# Altium project PCB_Project.PrjPcb
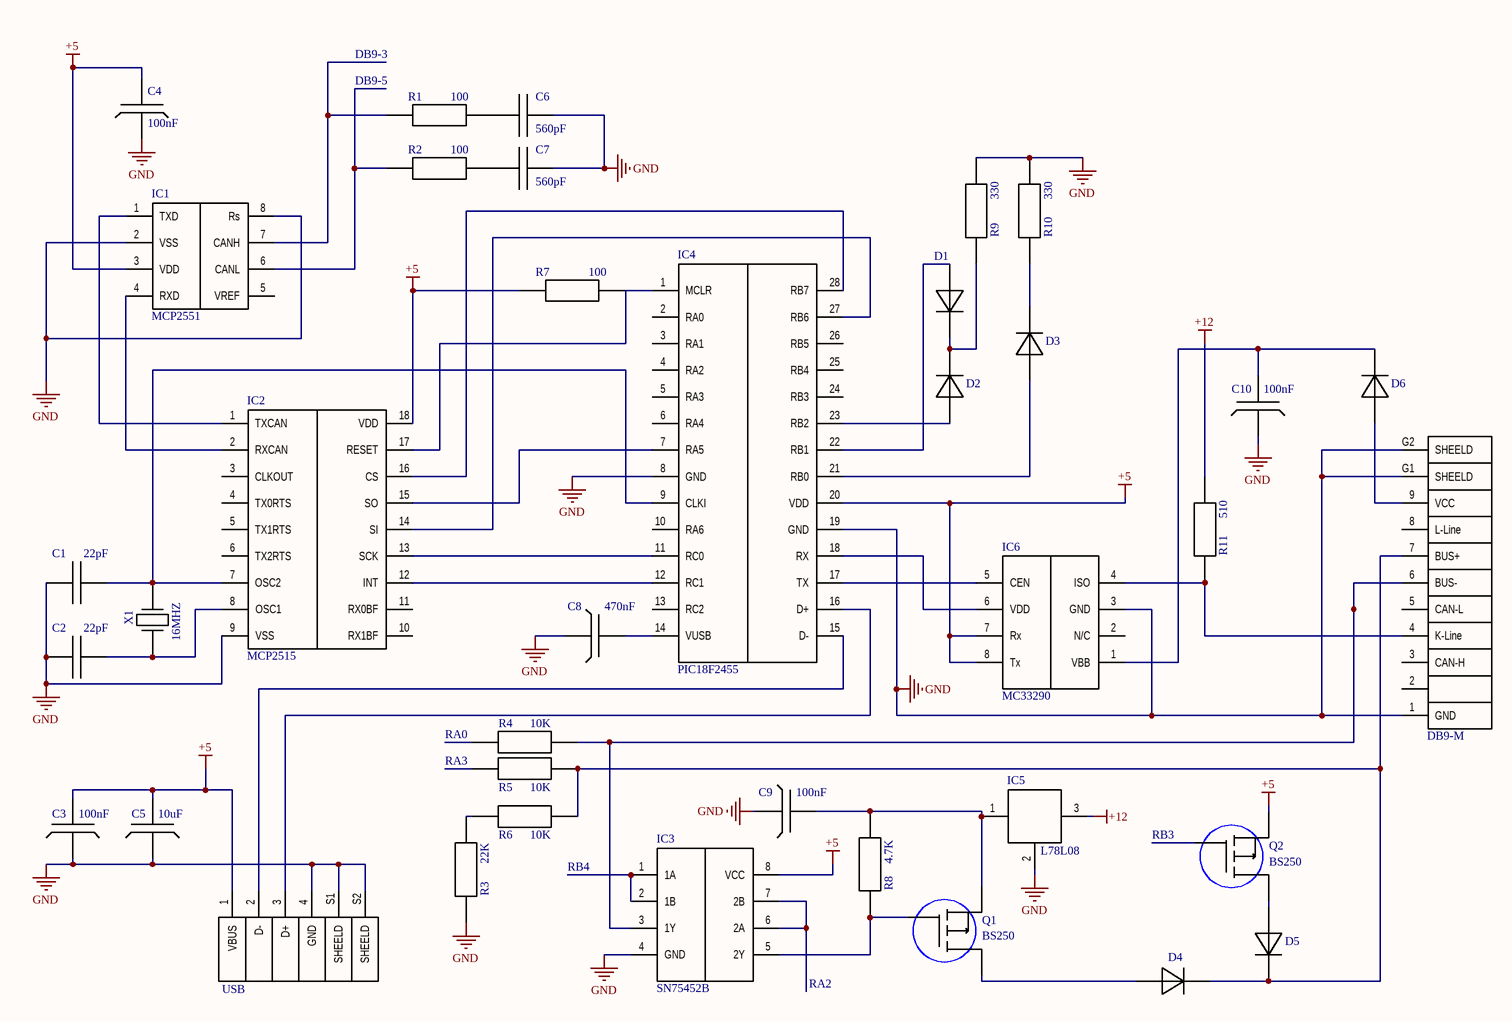
[diagram p0: Sheet1.SchDoc]
1 sheet, 38 parts. Net scope: global (net labels, ports and power ports of the same name join across sheets).
Board file: PCB1.PcbDoc

## Sheet Sheet1.SchDoc
size 420 x 297 mm; SheetNumber: 1; SheetTotal: 1

### Parts
C1  22pF  [C0805]
C2  22pF  [C0805]
C3  100nF  [C0805]
C4  100nF  [C0805]
C5  10uF  [C0805]
C6  560pF  [C0805]
C7  560pF  [C0805]
C8  470nF  [C0805]
C9  100nF  [C0805]
C10  100nF  [C0805]
D1  Diode  [1N4148]  (value not drawn)
D2  Diode  [1N4148]  (value not drawn)
D3  Diode  [1N4148]  (value not drawn)
D4  Diode  [1N4148]  (value not drawn)
D5  Diode  [1N4148]  (value not drawn)
D6  Diode  [1N4148]  (value not drawn)
IC1  MCP2551  [SOIC127P599X175-8N]
IC2  MCP2515  [MCP2515]
IC3  SN75452B  [SOIC127P599X175-8N]
IC4  PIC18F2455  [SOIC-SO28_N]
IC5  L78L08  [L78L08]
IC6  MC33290  [SO08]
P1  USB  [USB-A1HSW6]
P2  DB9-M  [DB9]
Q1  BS250  [BS250FTA]
Q2  BS250  [BS250FTA]
R1  100  [J1-0603]
R2  100  [J1-0603]
R3  22K  [J1-0603]
R4  10K  [J1-0603]
R5  10K  [J1-0603]
R6  10K  [J1-0603]
R7  100  [J1-0603]
R8  4.7K  [J1-0603]
R9  330  [J1-0603]
R10  330  [J1-0603]
R11  510  [J1-0603]
X1  16MHZ  [X-16.000MHZ-B4]

### Nets
+5: C3.1 C4.1 C5.1 IC1.3(VDD) IC2.18(VDD) IC3.8(VCC) IC4.20(VDD) IC6.7(Rx) IC6.8(Tx) P1.1(VBUS) Q2.2(S) R7.1
+12: IC5.3(IN) R11.2
GND: C1.1 C2.1 C3.2 C4.2 C5.2 C6.2 C7.2 C8.2 C9.2 C10.2 IC1.2(VSS) IC1.8(Rs) IC2.9(VSS) IC3.4(GND) IC4.8(GND) IC4.19(GND) IC5.2(GND) IC6.3(GND) P1.4(GND) P1.S1(SHEELD) P1.S2(SHEELD) P2.1(GND) P2.G1(SHEELD) P2.G2(SHEELD) R3.1 R9.2 R10.2
NetC1_2: C1.2 IC2.7(OSC2) IC4.9(CLKI) X1.2
NetC2_2: C2.2 IC2.8(OSC1) X1.1
NetC6_1: C6.1 R1.2
NetC7_1: C7.1 R2.2
NetC8_1: C8.1 IC4.14(VUSB)
NetC9_1: C9.1 IC5.1(OUT) Q1.2(S) R8.2
NetC10_1: C10.1 D6.2 IC6.1(VBB)
NetD1_1: D1.1 IC4.22(RB1)
NetD1_2: D1.2 D2.2 R9.1
NetD2_1: D2.1 IC4.23(RB2)
NetD3_1: D3.1 IC4.21(RB0)
NetD3_2: D3.2 R10.1
NetD4_1: D4.1 Q1.3(D)
NetD4_2: D4.2 D5.2 P2.7(BUS+) R5.2 R6.2
NetD5_1: D5.1 Q2.3(D)
NetD6_1: D6.1 P2.9(VCC)
NetIC1_1: IC1.1(TXD) IC2.1(TXCAN)
NetIC1_4: IC1.4(RXD) IC2.2(RXCAN)
NetIC1_6: IC1.6(CANL) R2.1
NetIC1_7: IC1.7(CANH) R1.1
NetIC2_12: IC2.12(INT) IC4.12(RC1)
NetIC2_13: IC2.13(SCK) IC4.11(RC0)
NetIC2_14: IC2.14(SI) IC4.27(RB6)
NetIC2_15: IC2.15(SO) IC4.7(RA5)
NetIC2_16: IC2.16(CS) IC4.28(RB7)
NetIC2_17: IC2.17(RESET) IC4.1(MCLR) R7.2
NetIC3_1: IC3.1(1A) IC3.2(1B)
NetIC3_3: IC3.3(1Y) P2.6(BUS-) R4.2
NetIC3_5: IC3.5(2Y) Q1.1(G) R8.1
NetIC3_6: IC3.6(2A) IC3.7(2B)
NetIC4_15: IC4.15(D-) P1.2(D-)
NetIC4_16: IC4.16(D+) P1.3(D+)
NetIC4_17: IC4.17(TX) IC6.5(CEN)
NetIC4_18: IC4.18(RX) IC6.6(VDD)
NetIC6_4: IC6.4(ISO) P2.4(K-Line) R11.1
NetR3_2: R3.2 R6.1

Not connected (* = marked no-connect by the designer): IC1 5(VREF); IC2 3(CLKOUT) 4(TX0RTS) 5(TX1RTS) 6(TX2RTS) 10(RX1BF) 11(RX0BF); IC4 2(RA0) 3(RA1) 4(RA2) 5(RA3) 6(RA4) 10(RA6) 13(RC2) 24(RB3) 25(RB4) 26(RB5); IC6 2(N/C); P2 2 3(CAN-H) 5(CAN-L) 8(L-Line); Q2 1(G); R4 1; R5 1

### Notes on the sheet
- DB9-3
- (near R1) DB9-5
- RA0
- RA3
- RB4
- (near Q2) RB3
- RA2
- ГУИР.441272.001
- Перв. примен.
- Справ. №
- Подп. и дата
- Инв. № дубл.
- Взам. инв. №
- Изм.
- Лист
- № докум.
- Подп.
- Дата
- Адаптер для диагностики
- автомобильного оборудования
- Лит.
- Масса
- Масштаб
- Разраб.
- Пров.
- Т.контр.
- Кириленко Г. Б.
- Смирнова Н. А.
- Схема электрическая принципиальная
- У
- 1
- Листов
- Инв. № подп.
- Н.контр.
- БГУИР гр. 990241
- Утв.
- Оформил
- Формат     А3

### Library data of the parts
C1 C2 C6 C7 = Cap: Capacitor; Published: 8-Jun-2000; LatestRevisionDate: 29-May-2009; LatestRevisionNote: IPC-7351 Footprint Added.; PackageReference: C0805; Publisher: Altium Limited; PackageDescription: Chip Capacitor
C3-C5 C8-C10 = Cap External: Capacitor with a designated external electrode; Published: 8-Jun-2000; LatestRevisionDate: 29-May-2009; LatestRevisionNote: IPC-7351 Footprint Added.; PackageReference: C0805; Publisher: Altium Limited; PackageDescription: Chip Capacitor
D1-D6 = Diode: Default Diode; Published: 8-Jun-2000; LatestRevisionDate: 17-Jul-2002; LatestRevisionNote: Re-released for DXP Platform.; PackageVersion: Sep-1996; PackageReference: SMC; Publisher: Altium Limited; PackageDescription: DO-214-AB/SMC; 2 C-Bend Leads; Body 7.9 x 5.9 mm, inc. leads (LxW); Code_JEDEC: DO-214-AB
IC1 = MCP2551-I/SN: Package: None; MP: MCP2551-I/SN; Price: None; Availability: Unavailable; Value: *
IC2 = MCP2515-E/SO: CANbus Controller CAN 2.0 SPI Interface 18-SOIC; MF: Microchip; MP: MCP2515-E/SO; Price: None; Package: SOIC-18 Microchip; Availability: Unavailable; SnapEDA_Link: https://www.snapeda.com/parts/MCP2515-E/SO/Microchip/view-part/100602/?ref=snap; Value: *
IC3 = SN75452BD: 30-V Dual output driver with NAND logic inputs; MF: Texas Instruments; Purchase-URL: https://pricing.snapeda.com/search/part/SN75452BD/?ref=eda; Value: *; SnapEDA_Link: https://www.snapeda.com/parts/SN75452BD/Texas+Instruments/view-part/?ref=snap; Package: SOIC-8 Texas Instruments; MP: SN75452BD; Check_prices: https://www.snapeda.com/parts/SN75452BD/Texas+Instruments/view-part/?ref=eda; Price: None; Availability: In Stock
IC4 = PIC18F2455-I/SO: High Performance, Enhanced Flash, USB Microcontroller with nanoWatt Technology, 24K Flash, 28-Pin SOIC, Industrial Temperature Range; Published: 29-Jan-2009; LatestRevisionDate: 02-Dec-2009; LatestRevisionNote: Updated to datasheet revision E, Aug-2008; DatasheetVersion: revE, Aug-2008; PackageVersion: revBB, Aug-2009; PackageReference: SOIC-SO28; Publisher: Altium Limited; PackageDescription: 28-Lead Plastic Small Outline (SO) - Wide 7.50mm Body [SOIC]; Supplier 1: Digi-Key; Supplier Part Number 1: PIC18F2455-I/SO-ND; Supplier 2: Farnell; Supplier Part Number 2: 1579598; Code_JEDEC: MS-013; ComponentLink1Description: Datasheet; ComponentLink1URL: http://ww1.microchip.com/downloads/en/DeviceDoc/39632e.pdf; ComponentLink2Description: Packaging Specification; ComponentLink2URL: http://www.microchip.com/stellent/groups/techpub_sg/documents/packagingspec/en012702.pdf; ComponentLink3Description: Microchip.com Home; ComponentLink3URL: http://www.microchip.com/
IC5 = L78L05ACU: Linear Voltage Regulator IC 1 Output 100mA SOT-89-3; MF: STMicroelectronics; Availability: Unavailable; Price: None; Package: SOT-89-3 STMicroelectronics; Value: *; SnapEDA_Link: https://www.snapeda.com/parts/L78L05ACU/STMicroelectronics/view-part/1236826/?ref=snap; MP: L78L05ACU
IC6 = MC33290: Heat Sink; Packages Cooled:TO-220; Thermal Resistance:8.8Â°C/W; Width:34.5mm; Height:50mm; Length:12.5mm; Mounting Type:PC Board Thru Hole; Package / Case:TO-220 ;RoHS Compliant: Yes; MF: NXP USA; Check_prices: https://www.snapeda.com/parts/MC33290/NXP+USA+Inc./view-part/?ref=eda; Package: TO-220-3 ON Semiconductor; MP: MC33290; Value: *; SnapEDA_Link: https://www.snapeda.com/parts/MC33290/NXP+USA+Inc./view-part/?ref=snap; Availability: In Stock; Price: None
P1 = USB-A1HSW6: USB - A Receptacle Connector 4 Position Through Hole, Right Angle; Price: None; Package: None; Availability: Unavailable; MP: USB-A1HSW6; Value: *
Q1 Q2 = BS250FTA: P-Channel 45V 90mA (Ta) 330mW (Ta) Surface Mount SOT-23-3; MF: Diodes Inc.; DigiKey-Purchase-URL: https://snapeda.com/shop?store=DigiKey&id=699; SnapEDA_Link: https://www.snapeda.com/parts/BS250FTA/Diodes%20Inc./view-part/699/?ref=snap; Availability: Unavailable; Value: *; Price: None; MP: BS250FTA; Package: SOT-23-3 Diodes Inc.
R1-R11 = Res3: Resistor; Published: 8-Jun-2000; LatestRevisionDate: 29-May-2009; LatestRevisionNote: IPC-7351 Footprint Added.; PackageReference: J1-0603; Publisher: Altium Limited; PackageDescription: Chip Resistor
X1 = ABLS-16.000MHZ-B4: 16 MHz Â±30ppm Crystal 18pF 40 Ohms HC-49/US; MF: Abracon; MP: ABLS-16.000MHZ-B4; Check_prices: https://www.snapeda.com/parts/ABLS-16.000MHZ-B4/Abracon/view-part/?ref=eda; Availability: In Stock; SnapEDA_Link: https://www.snapeda.com/parts/ABLS-16.000MHZ-B4/Abracon/view-part/?ref=snap; Value: *; Price: None; Package: HC-49/US Abracon LLC; Purchase-URL: https://pricing.snapeda.com/search/part/ABLS-16.000MHZ-B4/?ref=eda